# Altium schematic sheet Mach dieu khien tu xa.SchDoc
size A3; SheetNumber: 1; SheetTotal: 1
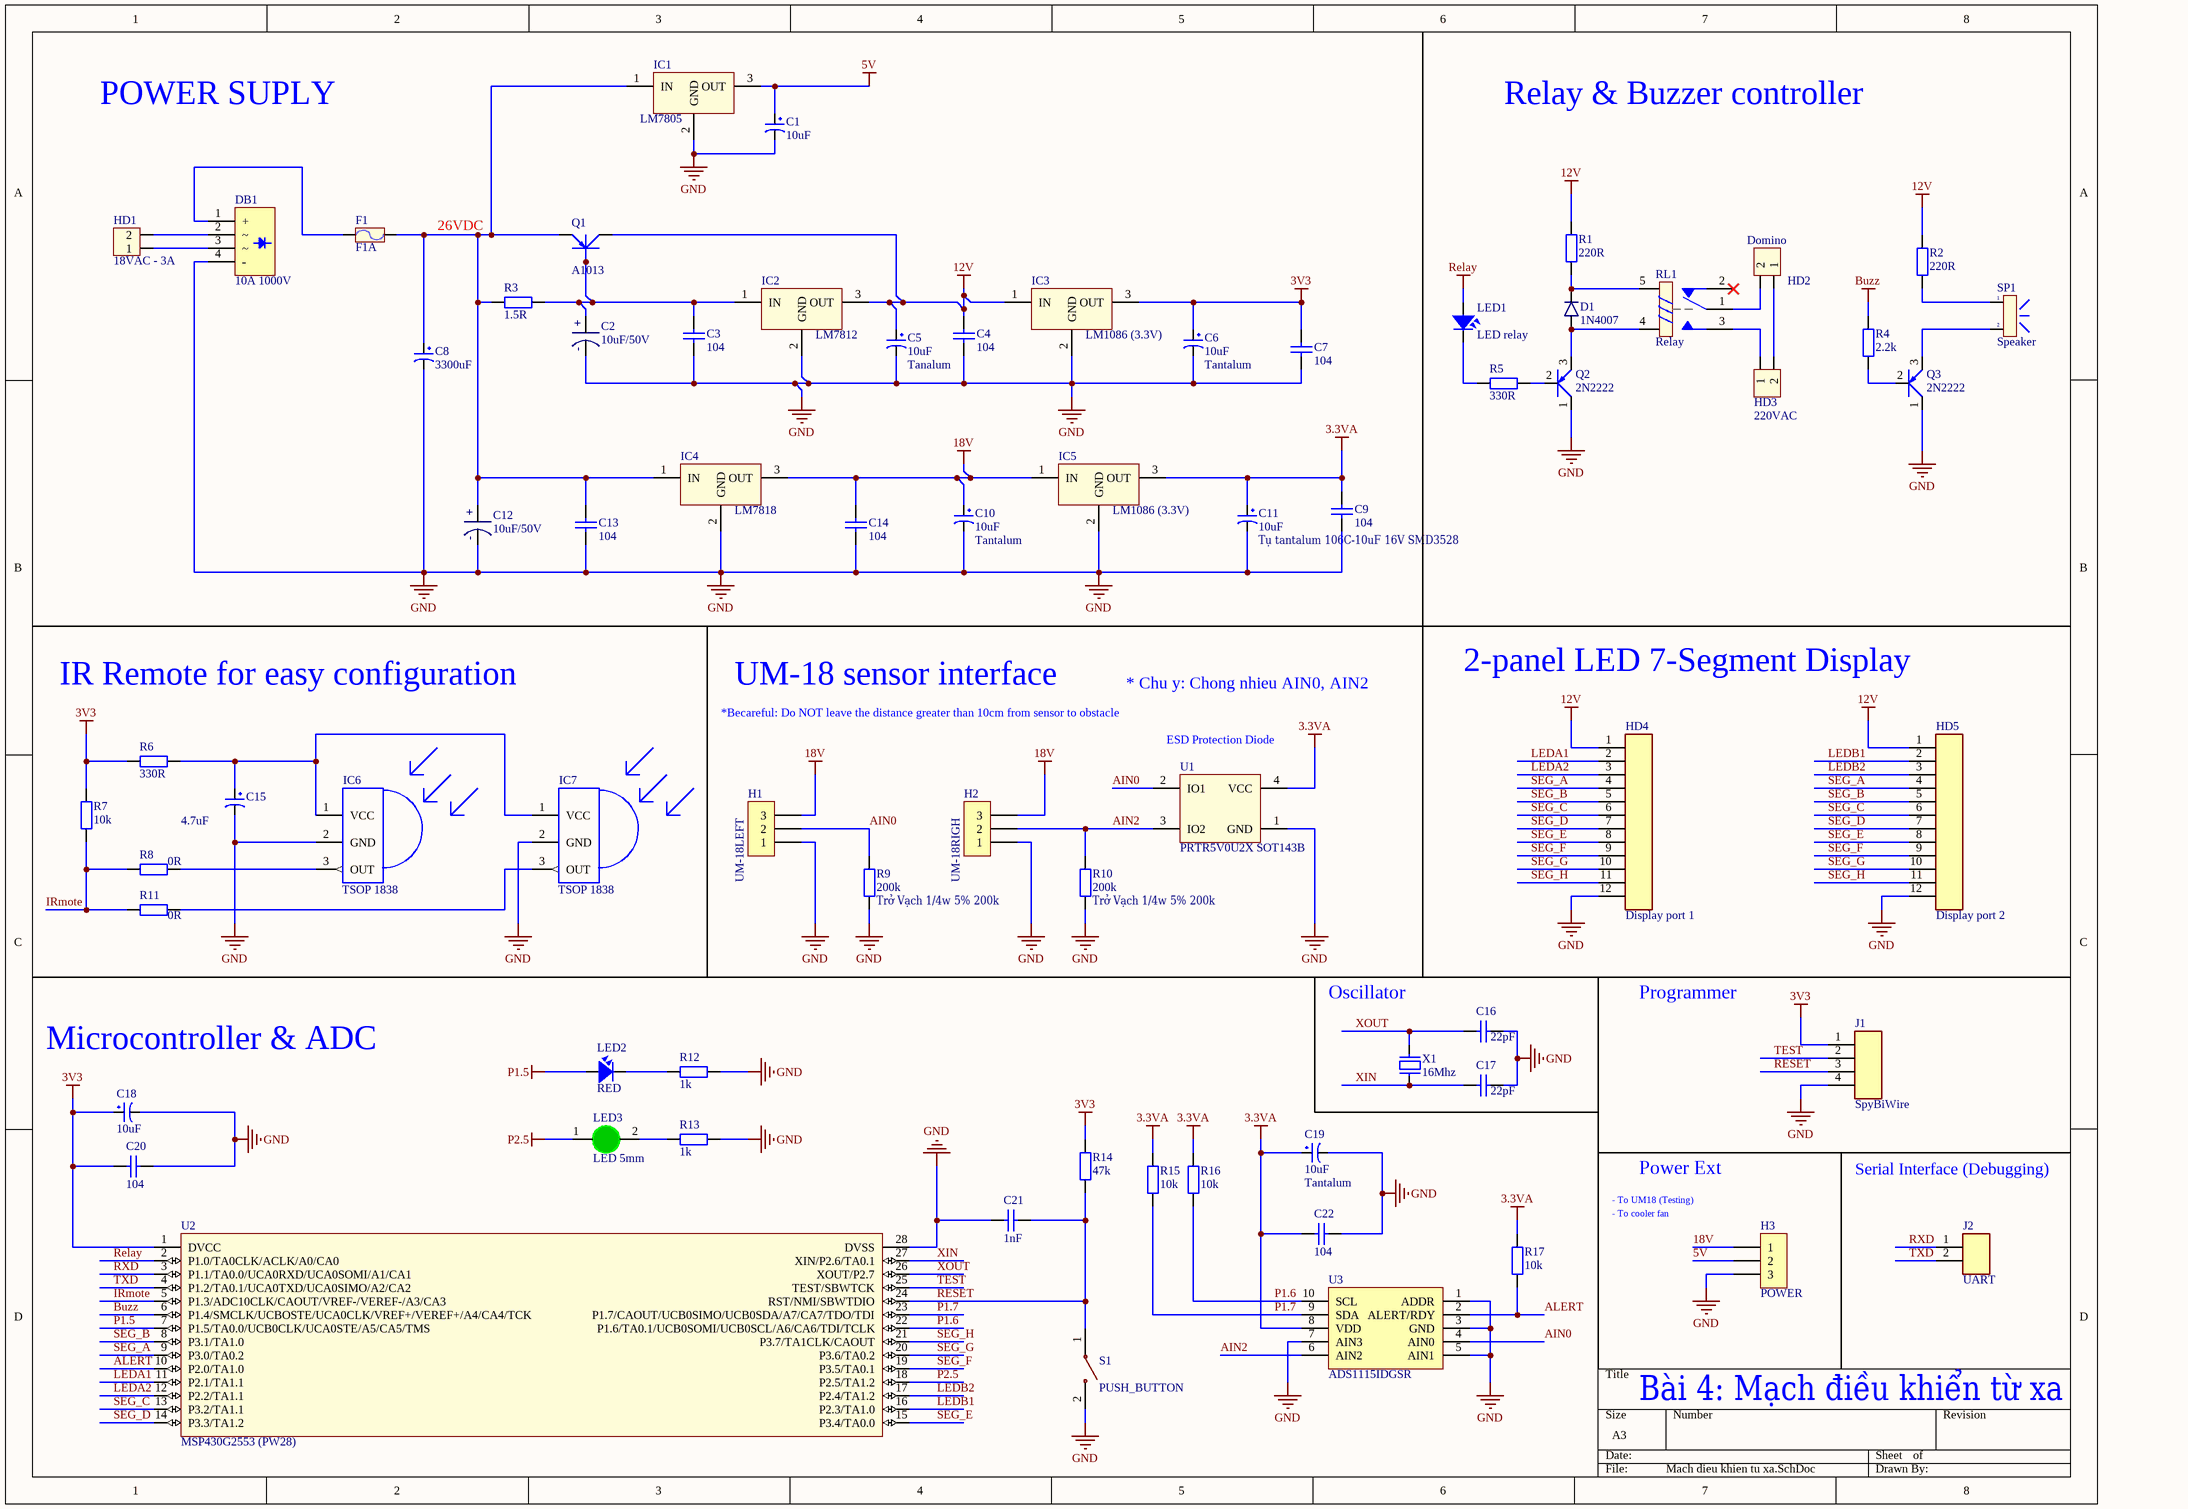
[diagram p0: Mach dieu khien tu xa.SchDoc]

## Parts
C1  10uF  [tu hoa 4mm]
C2  10uF/50V  [10uF/50V]
C3  104  [tu gom]
C4  104  [tu gom]
C5  10uF  Ten_Linh_Kien: Tanalum  [tu tantalum smd6032]
C6  10uF  Ten_Linh_Kien: Tantalum  [tu tantalum smd3528]
C7  104  [tu gom]
C8  3300uF  [tu hoa 18mm]
C9  104  [tu gom]
C10  10uF  Ten_Linh_Kien: Tantalum  [tu tantalum smd6032]
C11  10uF  Ten_Linh_Kien: Tụ tantalum 106C-10uF 16V SMD3528  [tu tantalum smd3528]
C12  10uF/50V  [10uF/50V]
C13  104  [tu gom]
C14  104  [tu gom]
C15  4.7uF  [tu tantalum smd3216]
C16  22pF  [tu gom]
C17  22pF  [tu gom]
C18  10uF  [tu hoa 4mm]
C19  10uF  Ten_Linh_Kien: Tantalum  [tu tantalum smd3216]
C20  104  [tu gom]
C21  1nF  [tu tantalum dip5.08]
C22  104  [tu gom]
D1  1N4007  [1N4007]
DB1  10A 1000V  [DIODE CAU 10A CAM]
F1  F1A  [Fuse]
H1  UM-18LEFT  [XH2.54M-3]
H2  UM-18RIGH  [XH2.54M-3]
H3  POWER  [XH2.54M-3]
HD1  18VAC - 3A  [HED2]
HD2  Domino  [HED2]
HD3  220VAC  [HED2]
HD4  Display port 1  [JST-2.5-12P]
HD5  Display port 2  [JST-2.5-12P]
IC1  LM7805  [QTO-220]
IC2  LM7812  [QTO-220]
IC3  LM1086 (3.3V)  [QTO-220]
IC4  LM7818  [QTO-220]
IC5  LM1086 (3.3V)  [QTO-220]
IC6  TSOP 1838  [TSOP1838]
IC7  TSOP 1838  [TSOP1838]
J1  SpyBiWire  [MALE-2.54-4P]
J2  UART  [MALE-2.54-2P]
LED1  LED relay  [LED-5-RED]
LED2  RED  [LED-5-RED]
LED3  LED 5mm  [LED-5MM-Green]
Q1  A1013  [QTO-92]
Q2  2N2222  [2N2222]
Q3  2N2222  [2N2222]
R1  220R  [tro vach 1w]
R2  220R  [tro vach 1w]
R3  1.5R  [tro vach 2w]
R4  2.2k  [tro vach 1/4w]
R5  330R  [tro vach 1/4w]
R6  330R  [tro vach 2w]
R7  10k  [tro vach 2w]
R8  0R  [tro smd 0603]
R9  200k  Ten_Linh_Kien: Trở Vạch 1/4w 5% 200k  [tro vach 1/4w]
R10  200k  Ten_Linh_Kien: Trở Vạch 1/4w 5% 200k  [tro vach 1/4w]
R11  0R  [tro smd 0603]
R12  1k  [tro vach 1w]
R13  1k  [tro vach 1w]
R14  47k  [tro vach 1/4w]
R15  10k  [tro vach 1/4w]
R16  10k  [tro vach 1/4w]
R17  10k  [tro vach 1/4w]
RL1  Relay  [Relay 5 Chan SRD]
S1  PUSH_BUTTON  [PUSH_BUTTON_SMD_3X4X2]
SP1  Speaker  [SPK]
U1  PRTR5V0U2X SOT143B  [PRTR5V0U2X]
U2  MSP430G2553 (PW28)  [MSP430G2553 (PW28)]
U3  ADS1115IDGSR  [VSOP-10_19.6_230_57X12_SMD]
X1  16Mhz  [Thach Anh 2 chan cam]

## Nets
3.3VA: C9.1 C11.1 C19.1 C22.1 IC5.3(OUT) R15.2 R16.2 R17.2 U1.4(VCC) U3.8(VDD)
3V3: C6.1 C7.1 C18.1 C20.1 IC3.3(OUT) J1.1 R6.1 R7.2 R14.2 U2.1(DVCC)
5V: C1.1 H3.2 IC1.3(OUT)
12V: C4.1 C5.1 HD4.1 HD5.1 IC2.3(OUT) IC3.1(IN) Q1.2(C) R1.2 R2.2
18V: C10.1 C14.1 H1.3 H2.3 H3.1 IC4.3(OUT) IC5.1(IN)
Buzz: R4.2 U2.6(P1.4/SMCLK/UCBOSTE/UCA0CLK/VREF+/VEREF+/A4/CA4/TCK)
GND: C1.2 C2.1 C3.2 C4.2 C5.2 C6.2 C7.2 C8.2 C9.2 C10.2 C11.2 C12.1 C13.2 C14.2 C15.2 C16.1 C17.1 C18.2 C19.2 C20.2 C21.2 C22.2 DB1.4(-) H1.1 H2.1 H3.3 HD4.12 HD5.12 IC1.2(GND) IC2.2(GND) IC3.2(GND) IC4.2(GND) IC5.2(GND) IC6.2(GND) IC7.2(GND) J1.4 Q2.1(E) Q3.1(E) R9.1 R10.1 R12.2 R13.2 S1.2 U1.1(GND) U2.28(DVSS) U3.1(ADDR) U3.3(GND) U3.5(AIN1) U3.7(AIN3)
P1.5: LED2.1 U2.7(P1.5/TA0.0/UCB0CLK/UCA0STE/A5/CA5/TMS)
P2.5: LED3.1(A) U2.18(P2.5/TA1.2)
Relay: LED1.1 U2.2(P1.0/TA0CLK/ACLK/A0/CA0)
AIN0: H1.2 R9.2 U1.2(IO1) U3.4(AIN0)
AIN2: H2.2 R10.2 U1.3(IO2) U3.6(AIN2)
ALERT: R17.1 U2.10(P2.0/TA1.0) U3.2(ALERT/RDY)
IRmote: R7.1 R8.1 R11.1 U2.5(P1.3/ADC10CLK/CAOUT/VREF-/VEREF-/A3/CA3)
LEDA1: HD4.2 U2.11(P2.1/TA1.1)
LEDA2: HD4.3 U2.12(P2.2/TA1.1)
LEDB1: HD5.2 U2.16(P2.3/TA1.0)
LEDB2: HD5.3 U2.17(P2.4/TA1.2)
P1.6: R16.1 U2.22(P1.6/TA0.1/UCB0SOMI/UCB0SCL/A6/CA6/TDI/TCLK) U3.10(SCL)
P1.7: R15.1 U2.23(P1.7/CAOUT/UCB0SIMO/UCB0SDA/A7/CA7/TDO/TDI) U3.9(SDA)
RESET: C21.1 J1.3 R14.1 S1.1 U2.24(RST/NMI/SBWTDIO)
RXD: J2.1 U2.3(P1.1/TA0.0/UCA0RXD/UCA0SOMI/A1/CA1)
SEG_A: HD4.4 HD5.4 U2.9(P3.0/TA0.2)
SEG_B: HD4.5 HD5.5 U2.8(P3.1/TA1.0)
SEG_C: HD4.6 HD5.6 U2.13(P3.2/TA1.1)
SEG_D: HD4.7 HD5.7 U2.14(P3.3/TA1.2)
SEG_E: HD4.8 HD5.8 U2.15(P3.4/TA0.0)
SEG_F: HD4.9 HD5.9 U2.19(P3.5/TA0.1)
SEG_G: HD4.10 HD5.10 U2.20(P3.6/TA0.2)
SEG_H: HD4.11 HD5.11 U2.21(P3.7/TA1CLK/CAOUT)
TEST: J1.2 U2.25(TEST/SBWTCK)
TXD: J2.2 U2.4(P1.2/TA0.1/UCA0TXD/UCA0SIMO/A2/CA2)
XIN: C17.2 U2.27(XIN/P2.6/TA0.1) X1.1
XOUT: C16.2 U2.26(XOUT/P2.7) X1.2
NetC2_2: C2.2 C3.1 IC2.1(IN) Q1.3(B) R3.2
NetC8_1: C8.1 C12.2 C13.1 F1.2 IC1.1(IN) IC4.1(IN) Q1.1(E) R3.1
NetC15_1: C15.1 IC6.1(VCC) IC7.1(VCC) R6.2
NetD1_1: D1.1 Q2.3(C) RL1.4
NetD1_2: D1.2 R1.1 RL1.5
NetDB1_1: DB1.1(+) F1.1
NetDB1_2: DB1.2 HD1.2
NetDB1_3: DB1.3 HD1.1
NetHD2_1: HD2.1 HD3.2
NetHD2_2: HD2.2 RL1.1
NetHD3_1: HD3.1 RL1.3
NetIC6_3: IC6.3(OUT) R8.2
NetIC7_3: IC7.3(OUT) R11.2
NetLED1_2: LED1.2 R5.2
NetLED2_2: LED2.2 R12.1
NetLED3_2: LED3.2(K) R13.1
NetQ2_2: Q2.2(B) R5.1
NetQ3_2: Q3.2(B) R4.1
NetQ3_3: Q3.3(C) SP1.2
NetR2_1: R2.1 SP1.1

Not connected (* = marked no-connect by the designer): RL1 2*

## Notes on the sheet
- POWER SUPLY
- Relay & Buzzer controller
- 26VDC
- IR Remote for easy configuration
- *Becareful: Do NOT leave the distance greater than 10cm from sensor to obstacle
- UM-18 sensor interface
- * Chu y: Chong nhieu AIN0, AIN2
- 2-panel LED 7-Segment Display
- (near U1) ESD Protection Diode
- Microcontroller & ADC
- Oscillator
- Programmer
- Power Ext
- Serial Interface (Debugging)
- - To cooler fan
- - To UM18 (Testing)
- Bài 4: Mạch điều khiển từ xa
- (in symbol 10uF/50V) +; -

## Library data of the parts
C1 C18 = Tu Hoa 10uF 16V 4x7: Cắm; So_Chan: 2; Don_Vi: Con; Ten_Linh_Kien: Tụ Hóa 10uF 16V; Ma_Hang: MH006855; Chung_Loai: Cắm; Kieu_Chan: *
C2 C12 = 10uF/50V: Electrolytic Capacitor 10uF/50V
C3 C4 C7 C9 C13 C14 C20 C22 = Tu gom 104 50V: Cắm; So_Chan: 2; Ten_Linh_Kien: Tụ gốm 104 100nF 50V; Don_Vi: Con; Ma_Hang: MH004761; Chung_Loai: Cắm; Kieu_Chan: *
C5 C10 = Tu tantalum 10uF 35V SMD6032: Dán; Don_Vi: Con; So_Chan: 2; Ma_Hang: MH007593; Chung_Loai: Dán; Kieu_Chan: *
C6 C11 = Tu tantalum 10uF 16V SMD3528: Dán; Don_Vi: Con; So_Chan: 2; Ma_Hang: MH007474; Chung_Loai: Dán; Kieu_Chan: *
C8 = Tu Hoa 3300uF 50V 18x35: Cắm; Don_Vi: Con; So_Chan: 2; Ten_Linh_Kien: Tụ Hóa 3300uF 50V 18x35MM; Ma_Hang: MH004423; Chung_Loai: Cắm; Kieu_Chan: *
C15 = Tu tantalum 4.7uF 16V SMD3216: Dán; Don_Vi: Con; So_Chan: 2; Ten_Linh_Kien: Tụ tantalum 475C-4.7uF 16V SMD3216; Ma_Hang: MH008686; Chung_Loai: Dán; Kieu_Chan: *
C16 C17 = Tu gom 22pF 50V: Cắm; Don_Vi: Con; So_Chan: 2; Ten_Linh_Kien: Tụ gốm 22P 50V; Ma_Hang: MH004771; Chung_Loai: Cắm; Kieu_Chan: *
C19 = Tu tantalum 10uF 16V SMD3216: Dán; Don_Vi: Con; So_Chan: 2; Ma_Hang: MH001954; Chung_Loai: Dán; Kieu_Chan: *
C21 = Tu tantalum 1nF 50V 20% DIP5.08: Cắm; Don_Vi: Con; So_Chan: 2; Ten_Linh_Kien: Tụ tantalum 102-1nF 50V 20% DIP5.08 (sứ vàng)(10PCS); Ma_Hang: MH003954; Chung_Loai: Cắm; Kieu_Chan: *
D1 = 1N4007: Rectifier Diode 1000V 1A DO-41; Mouser PN: 637-1N4007; ComponentLink1Description: Datasheet; ComponentLink1URL: https://www.mouser.com/datasheet/2/849/1n4001-2577232.pdf; Digikey PN: 4617-1N4007TB-ND; JLCPCB PN: C3033995
DB1 = Diode CAU 10A: Cắm; Ten_Linh_Kien: Diode Cầu 10A 1000V KBU1010; Don_Vi: Con; Ma_Hang: MH004295; Ghi_Chu: *; Kieu_Chan: *; Chung_Loai: cắm
F1 = Fuse: Designed by: VanDungEvn; Value: Fuse
H1-H3 = Header 3P 2.54 Duc Thang: Cắm; Ten_Linh_Kien: Header 3P XH2.54-3P Đực Thẳng; Don_Vi: Con; Ma_Hang: MH001292; Chung_Loai: Cắm
HD1-HD3 = Hed2: Header 2 (Green); Value: Header 2
HD4 HD5 = JST-2.5-12P
IC1 = LM78xx: On ap +, from + 5 to + 24VDC; Value: LM7805
IC2-IC5 = LM78xx: On ap +, from + 5 to + 24VDC; Value: LM7805
J1 = MALE-2.54-4P: Male Header Connector 2.54mm 4 Pins.; JLCPCB PN: C492403
J2 = MALE-2.54-2P: Male Header Connector 2.54mm 2 Pins.; JLCPCB PN: C492401
LED1 LED2 = LED: LED Single colour Green and Red; Value: LED 3 ly Single Colour
LED3 = LED 5mm Xanh La: Cắm; Don_Vi: Con; Ma_Hang: MH008969; Ten_Linh_Kien: LED 5MM Phủ Xanh (1000c); Ghi_Chu: *; Kieu_Chan: *; Chung_Loai: Cắm
Q1 = PNP_ECB: P 600mW, ECB; Value: A1015
Q2 Q3 = 2N2222: NPN switching transistor in a TO-18 metal package.
R1 R2 = Tro Vach 1W 5% 220R: Cắm; Don_Vi: Con; So_Chan: 2; Ten_Linh_Kien: Trở 5% 1w 220R; Ma_Hang: MH006414; Chung_Loai: Cắm; Kieu_Chan: *
R3 = Tro Vach 2W 1% 1.5R: Cắm; So_Chan: 2; Ten_Linh_Kien: Trở 1% 2w 1.5R; Don_Vi: Con; Ma_Hang: MH006312; Chung_Loai: Cắm; Kieu_Chan: *
R4 = Tro Vach 1/4W 5% 2.2k: Cắm; Don_Vi: Con; So_Chan: 2; Ten_Linh_Kien: Trở Vạch 1/4w 5% 2.2k; Ma_Hang: MH007293; Chung_Loai: Cắm; Kieu_Chan: *
R5 = Tro Vach 1/4W 1% 330R: Cắm; Don_Vi: Con; So_Chan: 2; Ten_Linh_Kien: Trở Vạch 1/4w 1% 330R; Ma_Hang: MH006348; Chung_Loai: Cắm; Kieu_Chan: *
R6 = Tro Vach 2W 5% 330R: Cắm; Ma_Hang: MH006373; Don_Vi: Con; So_Chan: 2; Ten_Linh_Kien: Trở 5% 2w 330R; Chung_Loai: Cắm; Kieu_Chan: *
R7 = Tro Vach 2W 5% 10k: Cắm; Don_Vi: Con; So_Chan: 2; Ten_Linh_Kien: Trở 5% 2w 10k; Ma_Hang: MH006358; Chung_Loai: Cắm; Kieu_Chan: *
R8 R11 = Tro 0603 1% 0R: Dán; Don_Vi: Con; So_Chan: 2; Ten_Linh_Kien: Trở 0603 1% 0R; Ma_Hang: MH005792; Chung_Loai: Dán; Kieu_Chan: *
R9 R10 = Tro Vach 1/4W 5% 200k: Cắm; Don_Vi: Con; So_Chan: 2; Ma_Hang: MH007295; Chung_Loai: Cắm; Kieu_Chan: *
R12 R13 = Tro Vach 1W 5% 1k: Cắm; Don_Vi: Con; So_Chan: 2; Ten_Linh_Kien: Trở 5% 1w 1k; Ma_Hang: MH006397; Chung_Loai: Cắm; Kieu_Chan: *
R14 = Tro Vach 1/4W 5% 47k: Cắm; Don_Vi: Con; So_Chan: 2; Ten_Linh_Kien: Trở Vạch 1/4w 5% 47k; Ma_Hang: MH004982; Chung_Loai: Cắm; Kieu_Chan: *
R15-R17 = Tro Vach 1/4W 5% 10k: Căm; Chung_Loai: Cắm; Don_Vi: Con; So_Chan: 2; Ten_Linh_Kien: Trở Vạch 1/4w 5% 10K; Ma_Hang: MH007354; Kieu_Chan: *
RL1 = Relay 5 Chan SRD: Relay 5 Chan; Ma_Hang: MH009374; Ten: Relay 5V10A SRD-05VDC-SL-C Chính Hãng
S1 = PUSH_BUTTON_SMD_3X4X2: Push Button Tactile Switch SMD 2 Pins 3x4x2mm.; JLCPCB PN: C231644
SP1 = SPK: Speaker Chip; Value: Speaker Chip
U1 = PRTR5V0U2X
U3 = IC_ADS1115IDGSR: Analog to Digital Converters - ADC 16B ADC w/ Int MUX PGA Comp Osc & Ref; Manufacturer: Texas Instruments; Alternate Part Number-1: NA; Manufacturer Part Number: ADS1115IDGSR; Case/Package: MSOP-10; Supplier-1: Mouser; Supplier Part Number-1: 595-ADS1115IDGSR
X1 = Thach Anh 2 chan Cam: Crystal For all Crystal 2pin.; Value: 4Mhz